# EAGLE design batterytester (EAGLE 6.3)

## Sheet 1 of 2
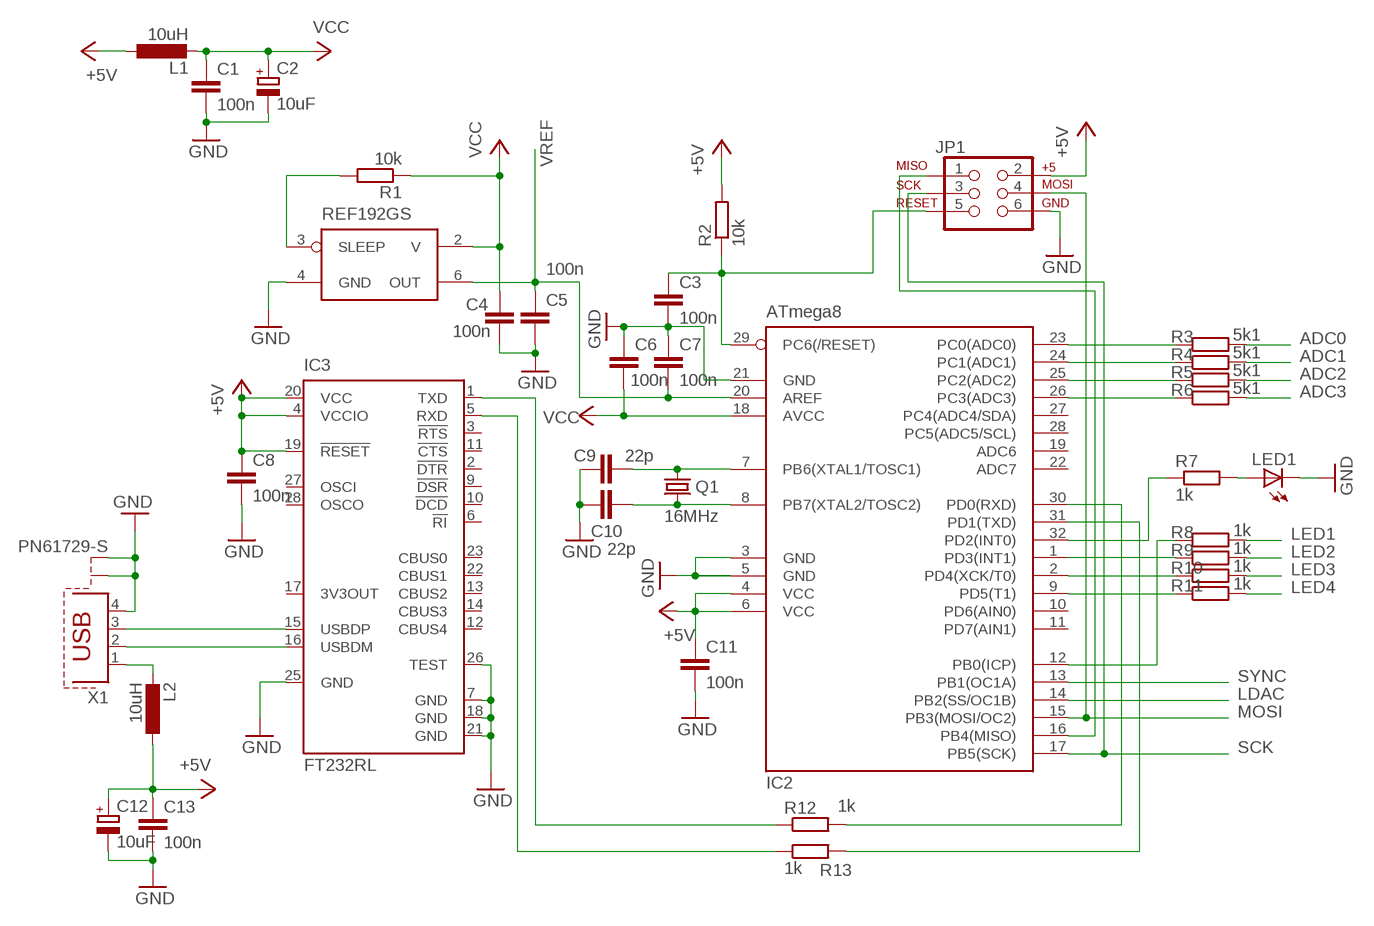
[diagram p0: schematic, sheet 1]

### Parts
C1  100n  C-EUC0805  [C0805]
C2  10uF  CPOL-EUSMCB  [SMC_B]
C3  100n  C-EUC0805  [C0805]
C4  100n  C-EUC0805  [C0805]
C5  100n  C-EUC0805  [C0805]
C6  100n  C-EUC0805  [C0805]
C7  100n  C-EUC0805  [C0805]
C8  100n  C-EUC0805  [C0805]
C9  22p  C-EUC0805  [C0805]
C10  22p  C-EUC0805  [C0805]
C11  100n  C-EUC0805  [C0805]
C12  10uF  CPOL-EUSMCB  [SMC_B]
C13  100n  C-EUC0805  [C0805]
IC1  REF192GS  REF192  [SO8]
IC2  ATmega8  MEGA8-AI  [TQFP32-08]
IC3  FT232RL  [SSOP28]
JP1  AVR_SPI_PRG_6NS  [2X3-NS]
L1  10uH  L-EUL1812  [L1812]
L2  10uH  L-EUL1812  [L1812]
LED1  LED3MM  [LED3MM]
Q1  16MHz  CRYSTALHC49S  [HC49/S]
R1  10k  R-EU_R0805  [R0805]
R2  10k  R-EU_R0805  [R0805]
R3  5k1  R-EU_R0805  [R0805]
R4  5k1  R-EU_R0805  [R0805]
R5  5k1  R-EU_R0805  [R0805]
R6  5k1  R-EU_R0805  [R0805]
R7  1k  R-EU_R0805  [R0805]
R8  1k  R-EU_R0805  [R0805]
R9  1k  R-EU_R0805  [R0805]
R10  1k  R-EU_R0805  [R0805]
R11  1k  R-EU_R0805  [R0805]
R12  1k  R-EU_R0805  [R0805]
R13  1k  R-EU_R0805  [R0805]
X1  PN61729-S  [PN61729-S]

### Nets
+5V: C8.1 C11.1 C12.+ C13.1 IC2.4(VCC) IC2.6(VCC) IC3.4(VCCIO) IC3.19(!RESET) IC3.20(VCC) JP1.2 L1.1 L2.1 R2.2 ; also sheet 2
ADC0: R3.2 ; also sheet 2
ADC1: R4.2 ; also sheet 2
ADC2: R5.2 ; also sheet 2
ADC3: R6.2 ; also sheet 2
GND: C1.2 C2.- C3.2 C4.2 C5.2 C6.1 C7.1 C8.2 C9.1 C10.1 C11.2 C12.- C13.2 IC1.4(GND) IC2.3(GND) IC2.5(GND) IC2.21(GND) IC3.7(GND) IC3.18(GND) IC3.21(GND) IC3.25(GND) IC3.26(TEST) JP1.6 LED1.K(C) X1.4 X1.S1 X1.S2 ; also sheet 2
LDAC: IC2.14(PB2(SS/OC1B)) ; also sheet 2
LED1: R8.2 ; also sheet 2
LED2: R9.2 ; also sheet 2
LED3: R10.2 ; also sheet 2
LED4: R11.2 ; also sheet 2
MOSI: IC2.15(PB3(MOSI/OC2)) JP1.4 ; also sheet 2
N$2: IC3.1(TXD) R12.1
N$3: IC3.5(RXD) R13.1
N$4: IC2.30(PD0(RXD)) R12.2
N$5: C9.2 IC2.7(PB6(XTAL1/TOSC1)) Q1.1
N$6: C10.2 IC2.8(PB7(XTAL2/TOSC2)) Q1.2
N$7: IC2.31(PD1(TXD)) R13.2
N$8: IC3.16(USBDM) X1.2
N$11: IC2.9(PD5(T1)) R11.1
N$12: C3.1 IC2.29(PC6(/RESET)) JP1.5 R2.1
N$13: IC2.2(PD4(XCK/T0)) R10.1
N$14: IC2.12(PB0(ICP)) R8.1
N$15: LED1.A R7.2
N$16: IC2.32(PD2(INT0)) R7.1
N$17: IC2.23(PC0(ADC0)) R3.1
N$18: IC3.15(USBDP) X1.3
N$19: L2.2 X1.1
N$20: IC2.16(PB4(MISO)) JP1.1
N$25: IC1.3(SLEEP) R1.2
N$28: IC2.24(PC1(ADC1)) R4.1
N$29: IC2.25(PC2(ADC2)) R5.1
N$30: IC2.1(PD3(INT1)) R9.1
N$36: IC2.26(PC3(ADC3)) R6.1
SCK: IC2.17(PB5(SCK)) JP1.3 ; also sheet 2
SYNC: IC2.13(PB1(OC1A)) ; also sheet 2
VCC: C1.1 C2.+ C4.1 C6.2 IC1.2(V) IC2.18(AVCC) L1.2 R1.1 ; also sheet 2
VREF: C5.1 C7.2 IC1.6(OUT) IC2.20(AREF) ; also sheet 2
Unconnected: IC2.10(PD6(AIN0)) IC2.11(PD7(AIN1)) IC2.19(ADC6) IC2.22(ADC7) IC2.27(PC4(ADC4/SDA)) IC2.28(PC5(ADC5/SCL)) IC3.2(!DTR) IC3.3(!RTS) IC3.6(!RI) IC3.9(!DSR) IC3.10(!DCD) IC3.11(!CTS) IC3.12(CBUS4) IC3.13(CBUS2) IC3.14(CBUS3) IC3.17(3V3OUT) IC3.22(CBUS1) IC3.23(CBUS0) IC3.27(OSCI) IC3.28(OSCO)

## Sheet 2 of 2
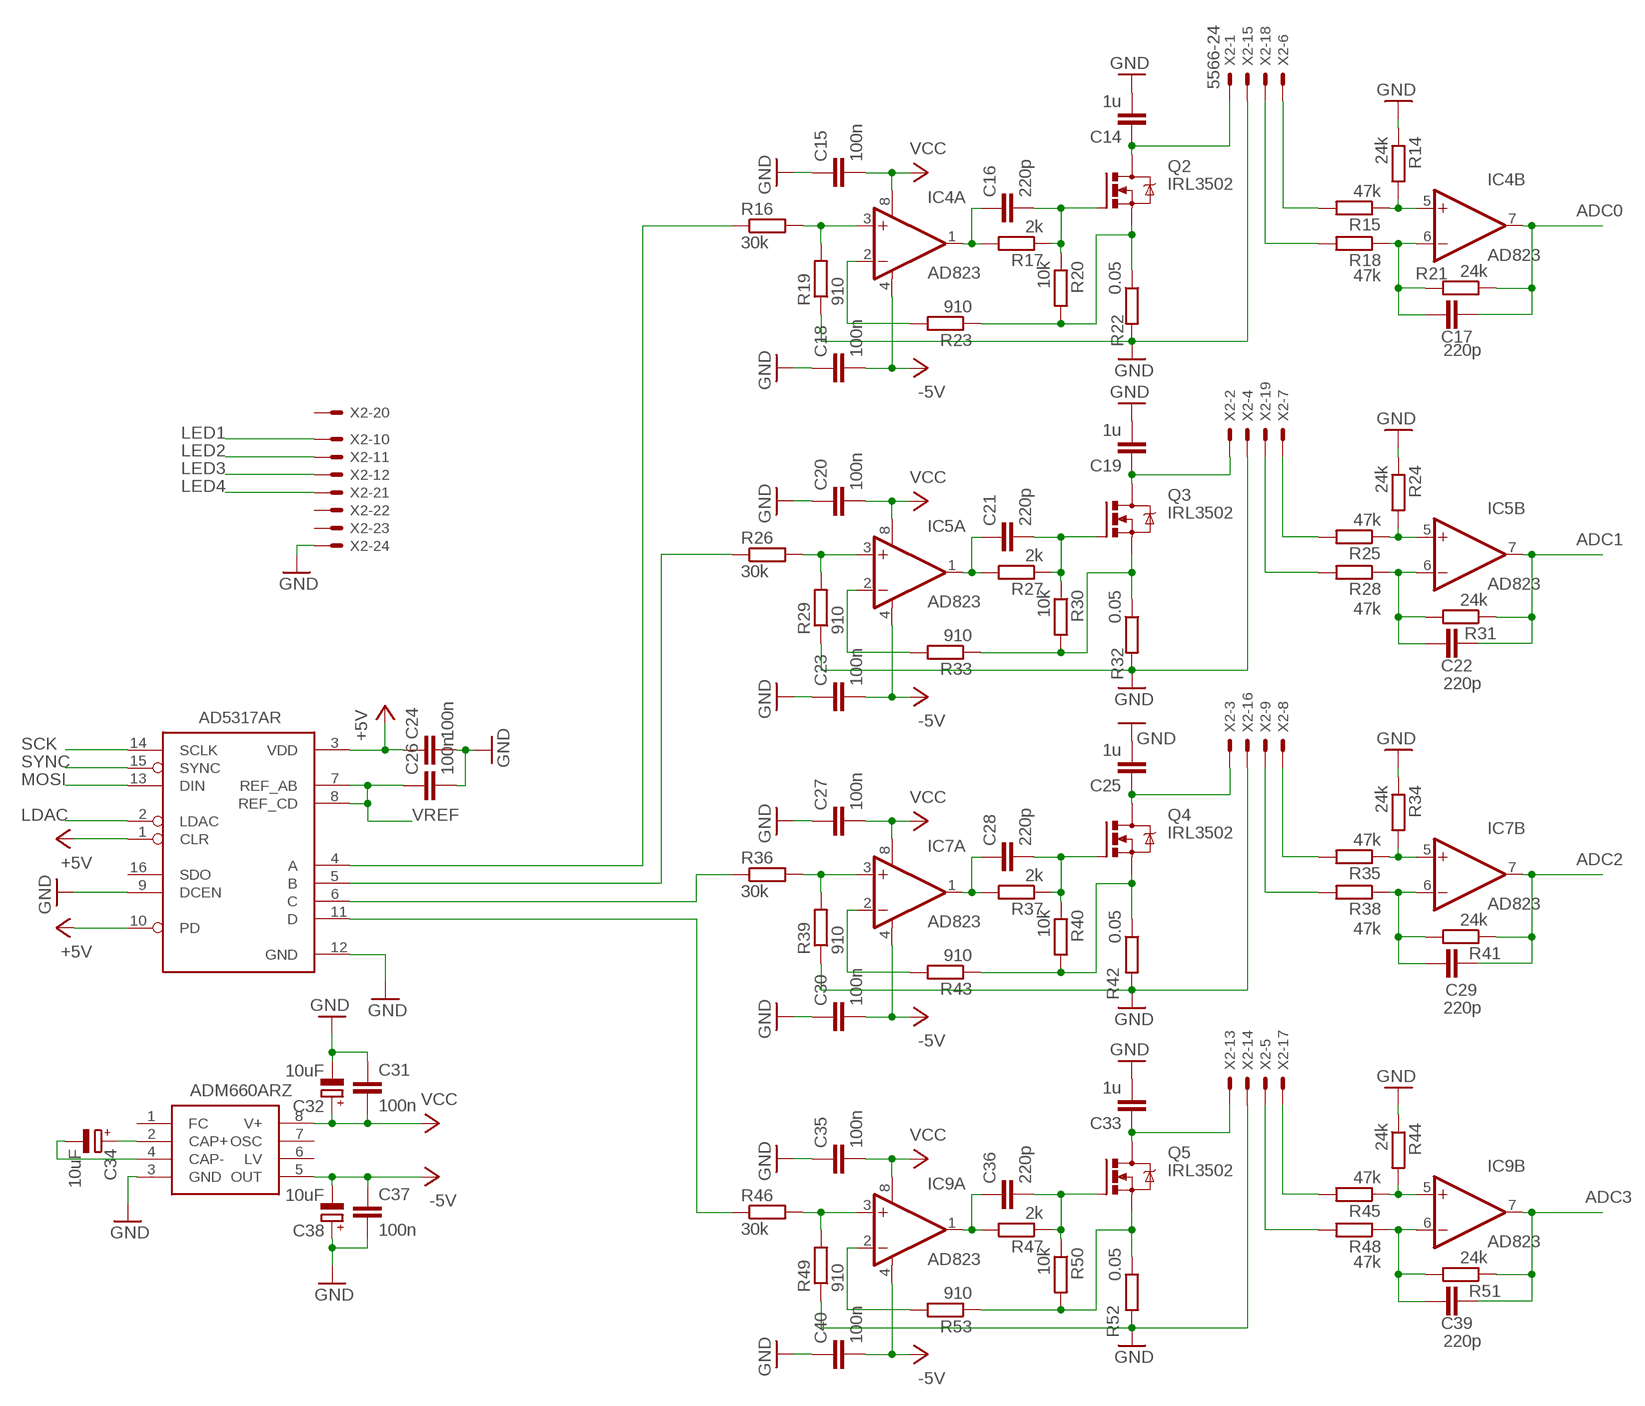
[diagram p1: schematic, sheet 2]

### Parts
C14  1u  C-EUC0805  [C0805]
C15  100n  C-EUC0805  [C0805]
C16  220p  C-EUC0805  [C0805]
C17  220p  C-EUC0805  [C0805]
C18  100n  C-EUC0805  [C0805]
C19  1u  C-EUC0805  [C0805]
C20  100n  C-EUC0805  [C0805]
C21  220p  C-EUC0805  [C0805]
C22  220p  C-EUC0805  [C0805]
C23  100n  C-EUC0805  [C0805]
C24  100n  C-EUC0805  [C0805]
C25  1u  C-EUC0805  [C0805]
C26  100n  C-EUC0805  [C0805]
C27  100n  C-EUC0805  [C0805]
C28  220p  C-EUC0805  [C0805]
C29  220p  C-EUC0805  [C0805]
C30  100n  C-EUC0805  [C0805]
C31  100n  C-EUC0805  [C0805]
C32  10uF  CPOL-EUSMCB  [SMC_B]
C33  1u  C-EUC0805  [C0805]
C34  10uF  CPOL-EUSMCB  [SMC_B]
C35  100n  C-EUC0805  [C0805]
C36  220p  C-EUC0805  [C0805]
C37  100n  C-EUC0805  [C0805]
C38  10uF  CPOL-EUSMCB  [SMC_B]
C39  220p  C-EUC0805  [C0805]
C40  100n  C-EUC0805  [C0805]
IC4  AD823  [SO8]
IC5  AD823  [SO8]
IC6  AD5317AR  AD5317  [TSSOP16]
IC7  AD823  [SO8]
IC8  ADM660ARZ  ADM660  [SO8]
IC9  AD823  [SO8]
Q2  IRL3502  IRF540  [TO220BV]
Q3  IRL3502  IRF540  [TO220BV]
Q4  IRL3502  IRF540  [TO220BV]
Q5  IRL3502  IRF540  [TO220BV]
R14  24k  R-EU_R0805  [R0805]
R15  47k  R-EU_R0805  [R0805]
R16  30k  R-EU_R0805  [R0805]
R17  2k  R-EU_R0805  [R0805]
R18  47k  R-EU_R0805  [R0805]
R19  910  R-EU_R0805  [R0805]
R20  10k  R-EU_R0805  [R0805]
R21  24k  R-EU_R0805  [R0805]
R22  0.05  R-EU_R2512  [R2512]
R23  910  R-EU_R0805  [R0805]
R24  24k  R-EU_R0805  [R0805]
R25  47k  R-EU_R0805  [R0805]
R26  30k  R-EU_R0805  [R0805]
R27  2k  R-EU_R0805  [R0805]
R28  47k  R-EU_R0805  [R0805]
R29  910  R-EU_R0805  [R0805]
R30  10k  R-EU_R0805  [R0805]
R31  24k  R-EU_R0805  [R0805]
R32  0.05  R-EU_R2512  [R2512]
R33  910  R-EU_R0805  [R0805]
R34  24k  R-EU_R0805  [R0805]
R35  47k  R-EU_R0805  [R0805]
R36  30k  R-EU_R0805  [R0805]
R37  2k  R-EU_R0805  [R0805]
R38  47k  R-EU_R0805  [R0805]
R39  910  R-EU_R0805  [R0805]
R40  10k  R-EU_R0805  [R0805]
R41  24k  R-EU_R0805  [R0805]
R42  0.05  R-EU_R2512  [R2512]
R43  910  R-EU_R0805  [R0805]
R44  24k  R-EU_R0805  [R0805]
R45  47k  R-EU_R0805  [R0805]
R46  30k  R-EU_R0805  [R0805]
R47  2k  R-EU_R0805  [R0805]
R48  47k  R-EU_R0805  [R0805]
R49  910  R-EU_R0805  [R0805]
R50  10k  R-EU_R0805  [R0805]
R51  24k  R-EU_R0805  [R0805]
R52  0.05  R-EU_R2512  [R2512]
R53  910  R-EU_R0805  [R0805]
X2  5566-24  5566-245569-24  [5569-24]

### Nets
+5V: C24.1 IC6.1(CLR) IC6.3(VDD) IC6.10(PD) ; also sheet 1
-5V: C18.2 C23.2 C30.2 C37.1 C38.- C40.2 IC4.4(A:V-) IC5.4(A:V-) IC7.4(A:V-) IC8.5(OUT) IC9.4(A:V-)
ADC0: C17.2 IC4.7(B:OUT) R21.1 ; also sheet 1
ADC1: C22.2 IC5.7(B:OUT) R31.1 ; also sheet 1
ADC2: C29.2 IC7.7(B:OUT) R41.1 ; also sheet 1
ADC3: C39.2 IC9.7(B:OUT) R51.1 ; also sheet 1
B0: C14.1 Q2.D X2.1
B0+: R15.2 X2.6
B0-: R18.2 X2.18
B1: C19.1 Q3.D X2.2
B1+: R25.2 X2.7
B1-: R28.2 X2.19
B2: C25.1 Q4.D X2.3
B2+: R35.2 X2.8
B2-: R38.2 X2.9
B3: C33.1 Q5.D X2.13
B3+: R45.2 X2.17
B3-: R48.2 X2.5
GND: C14.2 C15.1 C18.1 C19.2 C20.1 C23.1 C24.2 C25.2 C26.2 C27.1 C30.1 C31.1 C32.- C33.2 C35.1 C37.2 C38.+ C40.1 IC6.9(DCEN) IC6.12(GND) IC8.3(GND) R14.1 R19.1 R22.2 R24.1 R29.1 R32.2 R34.1 R39.1 R42.2 R44.1 R49.1 R52.2 X2.4 X2.14 X2.15 X2.16 X2.24 ; also sheet 1
LDAC: IC6.2(LDAC) ; also sheet 1
LED1: X2.10 ; also sheet 1
LED2: X2.11 ; also sheet 1
LED3: X2.12 ; also sheet 1
LED4: X2.21 ; also sheet 1
MOSI: IC6.13(DIN) ; also sheet 1
N$1: IC4.3(A:+IN) R16.2 R19.2
N$9: Q2.S R20.2 R22.1 R23.1
N$10: Q3.S R30.2 R32.1 R33.1
N$21: C34.+ IC8.2(CAP+)
N$22: C34.- IC8.4(CAP-)
N$23: IC4.2(A:-IN) R23.2
N$24: C16.1 IC4.1(A:OUT) R17.2
N$26: C16.2 Q2.G R17.1 R20.1
N$27: Q4.S R40.2 R42.1 R43.1
N$34: IC4.5(B:+IN) R14.2 R15.1
N$35: C17.1 IC4.6(B:-IN) R18.1 R21.2
N$37: Q5.S R50.2 R52.1 R53.1
N$38: IC5.3(A:+IN) R26.2 R29.2
N$39: IC5.2(A:-IN) R33.2
N$40: C21.1 IC5.1(A:OUT) R27.2
N$41: C21.2 Q3.G R27.1 R30.1
N$47: IC5.5(B:+IN) R24.2 R25.1
N$48: C22.1 IC5.6(B:-IN) R28.1 R31.2
N$50: IC7.3(A:+IN) R36.2 R39.2
N$51: IC7.2(A:-IN) R43.2
N$52: C28.1 IC7.1(A:OUT) R37.2
N$53: C28.2 Q4.G R37.1 R40.1
N$59: IC7.5(B:+IN) R34.2 R35.1
N$60: C29.1 IC7.6(B:-IN) R38.1 R41.2
N$62: IC9.3(A:+IN) R46.2 R49.2
N$63: IC9.2(A:-IN) R53.2
N$64: C36.1 IC9.1(A:OUT) R47.2
N$65: C36.2 Q5.G R47.1 R50.1
N$71: IC9.5(B:+IN) R44.2 R45.1
N$72: C39.1 IC9.6(B:-IN) R48.1 R51.2
N$74: IC6.4(A) R16.1
N$75: IC6.5(B) R26.1
N$76: IC6.6(C) R36.1
N$77: IC6.11(D) R46.1
SCK: IC6.14(SCLK) ; also sheet 1
SYNC: IC6.15(SYNC) ; also sheet 1
VCC: C15.2 C20.2 C27.2 C31.2 C32.+ C35.2 IC4.8(A:V+) IC5.8(A:V+) IC7.8(A:V+) IC8.8(V+) IC9.8(A:V+) ; also sheet 1
VREF: C26.1 IC6.7(REF_AB) IC6.8(REF_CD) ; also sheet 1
Unconnected: IC6.16(SDO) IC8.1(FC) IC8.6(LV) IC8.7(OSC) X2.20 X2.22 X2.23

## Library data of the parts
C1 C3-C11 C13-C31 C33 C35-C37 C39 C40 = olegart-passive:C-EU: CAPACITOR, European symbol
C2 C12 C32 C34 C38 = olegart-passive:CPOL-EU: POLARIZED CAPACITOR, European symbol
IC1 = batterytester:REF192: Precision Micropower, Low Dropout Voltage References
IC2 = atmel:MEGA8: MICROCONTROLLER 8 Kbytes FLASH, 1 kbytes SRAM, 512 bytes EEPROM, USART, 6-channel 10 bit ADC, 2-channel 8 bit ADC Pin compatible with Atmega48, ATMega88, ATMega168 Source: avr.lbr
IC3 = ftdichip:FT232R: Source: http://www.ftdichip.com/Documents/DataSheets/DS_FT232R_v104.pdf
IC4 IC5 IC7 IC9 = olegart-ic:AD823: Dual, 16 MHz, Rail-to-Rail FET Input Amplifier AD823
IC6 = batterytester:AD5317: AD5317 10-bit 4-channel DAC
IC8 = olegart-ic:ADM660: CMOS Switched-Capacitor Voltage Converter
JP1 = olegart-connectors:AVR_SPI_PRG_6: AVR ISP 6 Pin This is the reduced ISP connector for AVR programming. Common on Arduino. This footprint will take up less PCB space and can be used with a 10-pin to 6-pin adapter such as SKU: BOB-08508
L1 L2 = resistor:L-EU: INDUCTOR, European symbol
LED1 = olegart-opto:LED: LED OSRAM: - CHIPLED LG R971, LG N971, LY N971, LG Q971, LY Q971, LO R971, LY R971 LH N974, LH R974 LS Q976, LO Q976, LY Q976 LO Q996 - Hyper CHIPLED LW Q18S LB Q993, LB Q99A, LB R99A - SideLED LS A670, LO A670, LY A670, LG A670, LP A670 LB A673, LV A673, LT A673, LW A673 LH A674 LY A675 LS A676, LA A676, LO A676, LY A676, LW A676 LS A679, LY A679, LG A679 - Hyper Micro SIDELED® LS Y876, LA Y876, LO Y876, LY Y876 LT Y87S - SmartLED LW L88C, LW L88S LB L89C, LB L89S, LG L890 LS L89K, LO L89K, LY L89K LS L896, LA L896, LO L896, LY L896 - TOPLED LS T670, LO T670, LY T670, LG T670, LP T670 LSG T670, LSP T670, LSY T670, LOP T670, LYG T670 LG T671, LOG T671, LSG T671 LB T673, LV T673, LT T673, LW T673 LH T674 LS T676, LA T676, LO T676, LY T676, LB T676, LH T676, LSB T676, LW T676 LB T67C, LV T67C, LT T67C, LS T67K, LO T67K, LY T67K, LW E67C LS E67B, LA E67B, LO E67B, LY E67B, LB E67C, LV E67C, LT E67C LW T67C LS T679, LY T679, LG T679 LS T770, LO T770, LY T770, LG T770, LP T770 LB T773, LV T773, LT T773, LW T773 LH T774 LS E675, LA E675, LY E675, LS T675 LS T776, LA T776, LO T776, LY T776, LB T776 LHGB T686 LT T68C, LB T68C - Hyper Mini TOPLED® LB M676 - Mini TOPLED Santana® LG M470 LS M47K, LO M47K, LY M47K Source: http://www.osram.convergy.de LUXEON: - LUMILED® LXK2-PW12-R00, LXK2-PW12-S00, LXK2-PW14-U00, LXK2-PW14-V00 LXK2-PM12-R00, LXK2-PM12-S00, LXK2-PM14-U00 LXK2-PE12-Q00, LXK2-PE12-R00, LXK2-PE12-S00, LXK2-PE14-T00, LXK2-PE14-U00 LXK2-PB12-K00, LXK2-PB12-L00, LXK2-PB12-M00, LXK2-PB14-N00, LXK2-PB14-P00, LXK2-PB14-Q00 LXK2-PR12-L00, LXK2-PR12-M00, LXK2-PR14-Q00, LXK2-PR14-R00 LXK2-PD12-Q00, LXK2-PD12-R00, LXK2-PD12-S00 LXK2-PH12-R00, LXK2-PH12-S00 LXK2-PL12-P00, LXK2-PL12-Q00, LXK2-PL12-R00 Source: www.luxeon.com KINGBRIGHT: KA-3528ASYC Source: www.kingbright.com
Q1 = crystal:CRYSTAL: CRYSTAL
Q2-Q5 = transistor-power:IRF540: HEXFET Power MOSFET
R1-R53 = olegart-passive:R-EU_: RESISTOR, European symbol
X1 = con-berg:PN61729-S: BERG USB connector
X2 = batterytester:5566-24: Mini FIT connector 24 pol Source: http://www.molex.com

## Board
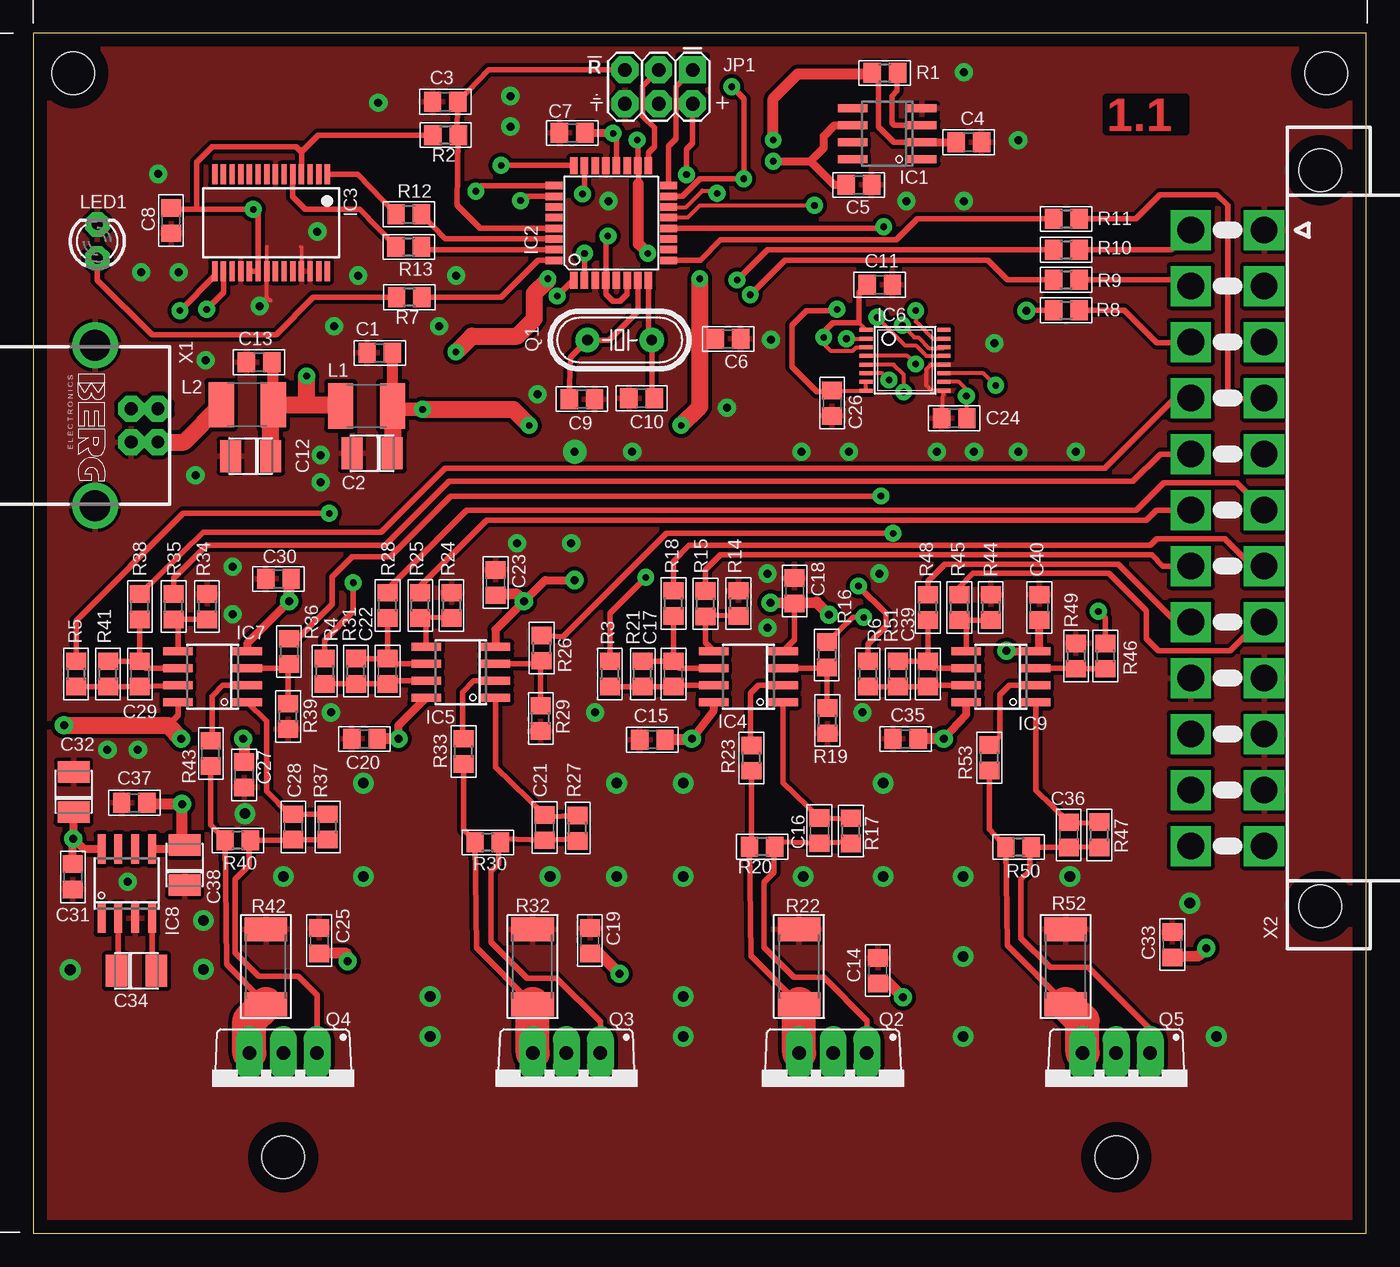
[diagram p2: board, top side]
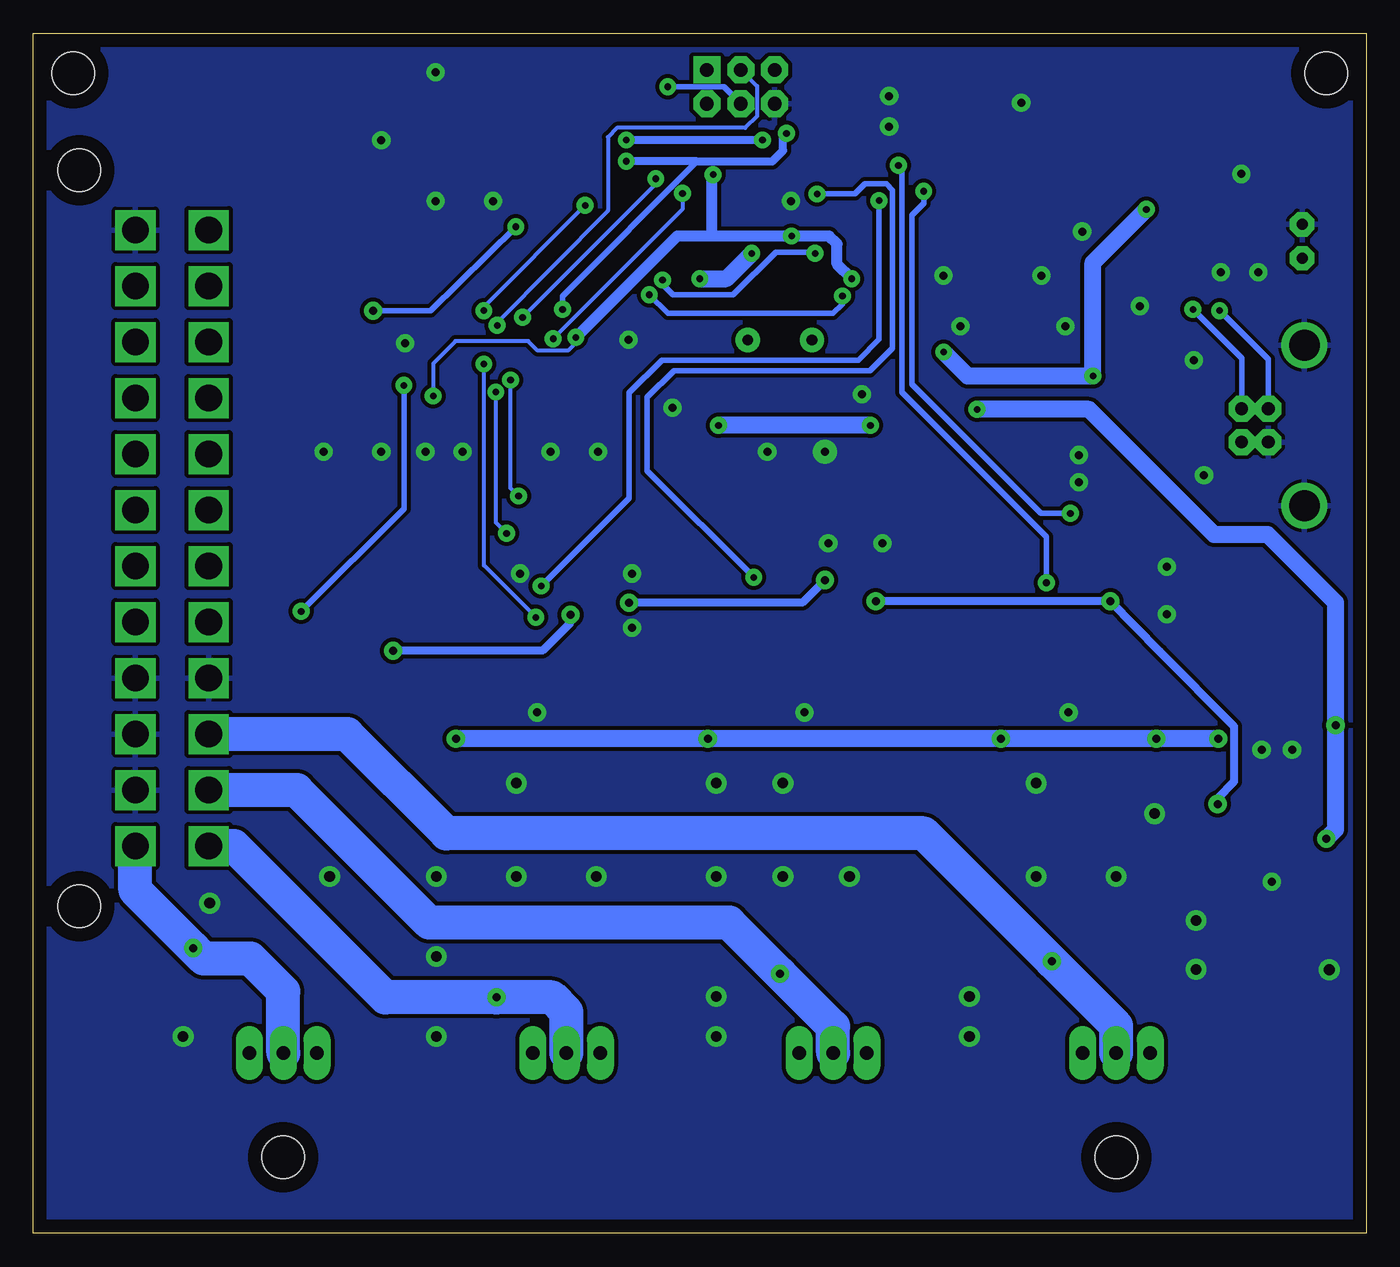
[diagram p3: board, bottom side, seen from below]

Size 100 x 90 mm. Coordinates in mm from the lower left corner, seen from the top.
Outline: 0,0 100,0 100,90 0,90 0,0
Copper layers (1*16): Top 0.035mm / dielectric 1.5mm / Bottom 0.035mm
Design rules "batterytester": minimum track width 10mil, minimum drill 24mil, track to track 0.3mm, track to pad 0.3mm, pad to pad 0.3mm, via to via 0.3mm, smd to smd 8mil, copper to edge 40mil, drill to drill 8mil, minimum pad ring 20mil, minimum via ring 15mil, stop-mask expansion 4mil, vias tented up to drill 0mil, thermal gap 10mil
Holes 3.2 mm at 18.75,5.7 81.25,5.7 3,87 97,87

### Footprints (pad centres in the part's own frame; a part is rotated, then mirrored left to right if it is on the bottom)
C0805 = smd 1.3 x 1.5: 1 -0.95,0; 2 0.95,0
SMC_B = smd 1.6 x 2.4: + -1.5,0; - 1.5,0
SO8 = smd 0.6 x 2.2: 1 -1.905,-2.6; 2 -0.635,-2.6; 3 0.635,-2.6; 4 1.905,-2.6; 5 1.905,2.6; 6 0.635,2.6; 7 -0.635,2.6; 8 -1.905,2.6
TQFP32-08 = smd 1.27 x 0.559: 1 -4.293,2.8; 2 -4.293,2; 3 -4.293,1.2; 4 -4.293,0.4; 5 -4.293,-0.4; 6 -4.293,-1.2; 7 -4.293,-2; 8 -4.293,-2.8; 17 4.293,-2.8; 18 4.293,-2; 19 4.293,-1.2; 20 4.293,-0.4; 21 4.293,0.4; 22 4.293,1.2; 23 4.293,2; 24 4.293,2.8 | smd 0.559 x 1.27: 9 -2.8,-4.293; 10 -2,-4.293; 11 -1.2,-4.293; 12 -0.4,-4.293; 13 0.4,-4.293; 14 1.2,-4.293; 15 2,-4.293; 16 2.8,-4.293; 25 2.8,4.293; 26 2,4.293; 27 1.2,4.293; 28 0.4,4.293; 29 -0.4,4.293; 30 -1.2,4.293; 31 -2,4.293; 32 -2.8,4.293
SSOP28 = smd 0.4 x 1.5: 1 -4.225,-3.625; 2 -3.575,-3.625; 3 -2.925,-3.625; 4 -2.275,-3.625; 5 -1.625,-3.625; 6 -0.975,-3.625; 7 -0.325,-3.625; 8 0.325,-3.625; 9 0.975,-3.625; 10 1.625,-3.625; 11 2.275,-3.625; 12 2.925,-3.625; 13 3.575,-3.625; 14 4.225,-3.625; 15 4.225,3.625; 16 3.575,3.625; 17 2.925,3.625; 18 2.275,3.625; 19 1.625,3.625; 20 0.975,3.625; 21 0.325,3.625; 22 -0.325,3.625; 23 -0.975,3.625; 24 -1.625,3.625; 25 -2.275,3.625; 26 -2.925,3.625; 27 -3.575,3.625; 28 -4.225,3.625
TSSOP16 = smd 0.305 x 0.991: 1 -2.275,-2.918; 2 -1.625,-2.918; 3 -0.975,-2.918; 4 -0.325,-2.918; 5 0.325,-2.918; 6 0.975,-2.918; 7 1.625,-2.918; 8 2.275,-2.918; 9 2.275,2.918; 10 1.625,2.918; 11 0.975,2.918; 12 0.325,2.918; 13 -0.325,2.918; 14 -0.975,2.918; 15 -1.625,2.918; 16 -2.275,2.918
2X3-NS = drill 1.016 square: 1 -2.54,-1.27 | drill 1.016 octagon: 2 -2.54,1.27; 3 0,-1.27; 4 0,1.27; 5 2.54,-1.27; 6 2.54,1.27
L1812 = smd 1.9 x 3.4: 1 -1.95,0; 2 1.95,0
LED3MM = drill 0.813 octagon: A -1.27,0; K 1.27,0
HC49/S = drill 0.813: 1 -2.413,0; 2 2.413,0
TO220BV = drill 1.016 long: D 0,-2.54; G -2.54,-2.54; S 2.54,-2.54
R0805 = smd 1.3 x 1.5: 1 -0.95,0; 2 0.95,0
R2512 = smd 1.8 x 3.2: 1 -2.8,0; 2 2.8,0
PN61729-S = drill 0.95 octagon: 1 1.25,4.71; 2 -1.25,4.71; 3 -1.25,2.71; 4 1.25,2.71 | drill 2.3 pad 2.9: S1 -6.02,0; S2 6.02,0
5569-24 = drill 2 square: 1 23.1,-2.75; 2 18.9,-2.75; 3 14.7,-2.75; 4 10.5,-2.75; 5 6.3,-2.75; 6 2.1,-2.75; 7 -2.1,-2.75; 8 -6.3,-2.75; 9 -10.5,-2.75; 10 -14.7,-2.75; 11 -18.9,-2.75; 12 -23.1,-2.75; 13 23.1,2.75; 14 18.9,2.75; 15 14.7,2.75; 16 10.5,2.75; 17 6.3,2.75; 18 2.1,2.75; 19 -2.1,2.75; 20 -6.3,2.75; 21 -10.5,2.75; 22 -14.7,2.75; 23 -18.9,2.75; 24 -23.1,2.75 | hole 3.2: -27.6,6.95; 27.6,6.95

### Placement (x,y rotation side)
C1  25.99,66.03 180 top
C2  25.42,58.49 180 top
C3  30.91,84.87 180 top
C4  70.19,81.83 0 top
C5  61.94,78.63 0 top
C6  52.12,67.08 180 top
C7  40.42,82.53 0 top
C8  10.33,75.96 270 top
C9  41.15,62.57 180 top
C10  45.63,62.63 0 top
C11  63.5,71.15 0 top
C12  16.3,58.29 180 top
C13  16.94,65.33 180 top
C14  63.35,19.7 90 top
C15  46.44,37.03 0 top
C16  58.98,30.21 270 top
C17  48.02,41.96 270 top
C18  57.12,48.19 270 top
C19  41.75,21.95 90 top
C20  24.84,37.08 0 top
C21  38.35,30.43 270 top
C22  26.57,42.16 270 top
C23  34.68,48.81 270 top
C24  69.09,61.13 180 top
C25  21.45,21.95 90 top
C26  59.93,62.26 270 top
C27  15.82,34.39 90 top
C28  19.5,30.48 270 top
C29  8,41.96 270 top
C30  18.39,49.08 0 top
C31  2.97,26.74 90 top
C32  3.02,33.11 90 top
C33  85.45,21.65 90 top
C34  7.74,19.69 0 top
C35  65.44,37.08 0 top
C36  77.68,29.89 270 top
C37  7.59,32.29 180 top
C38  11.34,27.62 90 top
C39  67.12,41.96 270 top
C40  75.47,46.95 270 top
IC1  64.07,82.46 90 top
IC2  43.35,75.78 90 top
IC3  17.84,75.8 180 top
IC4  53.65,41.75 90 top
IC5  32.08,42.08 90 top
IC6  65.4,65.48 270 top
IC7  13.45,41.75 90 top
IC8  7.02,26.23 0 top
IC9  72.6,41.75 90 top
JP1  46.92,85.99 180 top
L1  25,62.06 0 top
L2  16.05,62.14 180 top
LED1  4.8,74.4 90 top
Q1  43.99,67 0 top
Q2  60,11 180 top
Q3  40,11 180 top
Q4  18.75,11 180 top
Q5  81.25,11 180 top
R1  63.89,87.03 0 top
R2  30.93,82.37 180 top
R3  43.25,41.96 270 top
R4  21.85,42.16 270 top
R5  3.2,41.96 270 top
R6  62.6,41.96 270 top
R7  28.2,70.2 180 top
R8  77.5,69.23 0 top
R9  77.5,71.53 0 top
R10  77.5,73.78 0 top
R11  77.5,76.08 0 top
R12  28.17,76.43 0 top
R13  28.16,73.98 0 top
R14  52.92,47.24 270 top
R15  50.42,47.22 90 top
R16  59.53,43.39 270 top
R17  61.34,30.18 90 top
R18  48.02,47.24 90 top
R19  59.57,38.46 90 top
R20  54.67,29 180 top
R21  45.72,41.96 90 top
R22  57.46,20 90 top
R23  53.87,35.65 90 top
R24  31.37,47.09 270 top
R25  29.03,47.1 90 top
R26  38.13,43.9 270 top
R27  40.84,30.39 90 top
R28  26.57,47.09 90 top
R29  38.07,38.62 90 top
R30  34.09,29.32 180 top
R31  24.2,42.16 90 top
R32  37.46,20 90 top
R33  32.27,36.14 90 top
R34  13.03,47 270 top
R35  10.52,47 90 top
R36  19.18,43.65 270 top
R37  22.07,30.48 90 top
R38  8,47 90 top
R39  19.12,38.77 90 top
R40  15.35,29.47 180 top
R41  5.6,41.96 90 top
R42  17.46,20 90 top
R43  13.32,35.99 90 top
R44  71.83,46.95 270 top
R45  69.47,46.95 90 top
R46  80.43,43.3 270 top
R47  79.97,29.89 90 top
R48  67.12,46.95 90 top
R49  78.23,43.3 270 top
R50  73.92,28.97 180 top
R51  64.87,41.96 90 top
R52  77.46,20 90 top
R53  71.72,35.67 90 top
X1  4.63,60.59 270 top
X2  89.59,52.14 270 top

### Tracks (layer width: path | path; a pad name or v marks a point on that pad's centre or on a via)
+5V  (via drill 0.5)
  Top 0.305: 61.94,68.3 IC6.1 | IC6.3 61.76,66.45 61.5,66.2 59.8,66.2 59.4,66.6 59.4,67.1 | IC6.10 69.44,63.85 70,63.3 v70,62.8 70,61.19 C24.1
  Top 0.406: IC2.6 44.55,70.45 44,69.9 43.5,69.9 42.95,70.45 IC2.4 42.95,74.45 v43.11,74.8 | IC3.19 IC3.20 16.86,76.44 v16.5,76.8 12.25,76.8 | R2.2 21.37,82.37 20.11,81.11 20.11,81.08 | v59.3,67.2 59.4,67.1 59.4,67.7 60,68.3 61.94,68.3 61.94,70.53 C11.1 | v49,79.4 49,81.3 49.46,81.76 JP1.2 | 20.11,81.08 19.7,81.5 13.4,81.5 12.25,80.35 12.25,76.8 | 20.11,81.08 IC3.4 | C8.1 10.34,76.8 12.25,76.8
  Top 0.61: 38.6,71.5 v38.6,71.6
  Top 0.813: C13.1 18,65.12 L2.1
  Top 1.27: v31.7,66.1 32.9,67.3 36.3,67.3 37.6,68.6 37.6,70.5 38.6,71.5 | 20.5,62.14 L2.1 17.8,61.94 C12.+ | L1.1 23.05,62.14 20.5,62.14 | 20.5,62.14 v20.5,64.3
  Bottom 0.305: v70,62.8 70,65.23 68.32,66.91 62.87,66.91 62.16,66.2 59.9,66.2 59.4,66.7 59.4,67.1 v59.3,67.2
  Bottom 0.813: v38.6,71.6 39.7,72.7 39.7,74.2 40.3,74.8 v43.11,74.8 49.1,74.8 | 49.1,74.8 49.1,79.3 v49,79.4 | 49.1,74.8 51.7,74.8 v59.3,67.2
  Bottom 1.27: v31.7,66.1 29.9,64.3 v20.5,64.3 20.5,72.8 v16.5,76.8
-5V  (via drill 0.6)
  Top 0.406: IC4.4 57.12,44.52 C18.2
  Top 0.61: IC5.4 34.67,45.27 v36.8,47.4 38.4,49 v40.6,49 | v73,43.7 73.05,43.66 IC9.4 75.47,43.92 C40.2 | 19.1,47.3 v19.2,47.4 16.05,44.25 IC7.4 | v11.15,32.2 v11.14,32.19 | IC8.5 10.54,28.83 C38.-
  Top 0.813: v55.3,47.3 55.34,47.34 C18.2 58.76,47.34 v59.7,46.4 | C23.2 36.24,47.96 v36.8,47.4 | v19.2,47.4 19.2,49.09 C30.2 | C38.- 11.15,29.31 v11.15,32.2 8.6,32.2 C37.1
  Bottom 0.61: v36.8,47.4 v19.2,47.4 15.47,43.63 9.9,38 9.9,33.9 11.15,32.65 v11.15,32.2 | v40.6,49 42.3,47.3 v55.3,47.3 | v73,43.7 61.8,43.7 59.7,45.8 v59.7,46.4
ADC0
  Top 0.406: IC4.7 48.02,41.11 C17.2 R21.1 R3.2
ADC1
  Top 0.406: IC5.7 26.7,41.44 C22.2 R31.1 R4.2
ADC2
  Top 0.406: IC7.7 C29.2 R41.1 R5.2
ADC3
  Top 0.406: IC9.7 67.12,41.11 C39.2 R51.1 R6.2
B0  (via drill 0.6)
  Top 0.813: C14.1 64.1,18.85 v65.25,17.7
  Bottom 2.54: Q2.D 60,16.6 61.1,17.7 v65.25,17.7 73.6,17.7 84.94,29.04 X2.1
B0+
  Top 0.406: X2.6 84.76,50.04 83.9,50.9 51.57,50.9 50.42,49.75 R15.2
B0-
  Top 0.406: X2.18 91.46,50.04 89.4,52.1 84.3,52.1 83.8,51.6 49.2,51.6 48.02,50.42 R18.2
B1  (via drill 0.6)
  Top 0.813: C19.1 42.35,21.1 v43.98,19.48
  Bottom 2.54: Q3.D 40,15.5 v43.98,19.48 47.8,23.3 70.3,23.3 80.24,33.24 X2.2
B1+
  Top 0.406: X2.7 84.24,54.24 83.5,53.5 34.02,53.5 29.03,48.51 R25.2
B1-
  Top 0.406: X2.19 90.28,56.3 84.8,56.3 82.74,54.24 32.52,54.24 26.57,48.29 R28.2
B2  (via drill 0.6)
  Top 0.813: C25.1 23.5,21 v23.59,20.4
  Bottom 2.54: X2.3 76.44,37.44 69,30 33.19,30 v23.59,20.4 18.75,15.56 Q4.D
B2+
  Top 0.406: X2.8 84.54,58.44 82.5,56.4 31.2,56.4 26.4,51.6 13,51.6 10.52,49.12 R35.2
B2-
  Top 0.406: X2.9 85.64,62.64 80.4,57.4 30.9,57.4 26.1,52.6 12.74,52.6 R38.2
B3  (via drill 0.6)
  Top 0.813: C33.1 87.4,20.8 v88,21.4
  Bottom 2.54: X2.13 92.34,25.74 v88,21.4 87.2,20.6 83.7,20.6 81.25,18.15 Q5.D
B3+
  Top 0.406: X2.17 91.94,45.84 89.8,43.7 84.4,43.7 83.5,44.6 83.5,46.7 80.7,49.5 70.5,49.5 69.5,48.5 69.5,47.81 R45.2
B3-
  Top 0.406: X2.5 85.76,45.84 81.4,50.2 68.4,50.2 67.1,48.9 67.1,47.82 R48.2
GND  (via drill 0.6, 0.6 pad 1.78, 0.8)
  Top 0.254: IC3.25 20.11,73.96 20.07,74.01 | IC3.21 17.52,74 17.53,74.01
  Top 0.305: IC6.12 67.36,65.16 67,64.8 67,63.6 67.39,63.2 IC6.9 68.24,63.13 C24.2 | IC3.21 17.52,70.21 17.78,69.94
  Top 0.61: C24.2 68.2,61.09
  other vias: 48.77,26.76 43.77,26.76 38.77,26.76 57.77,26.76 63.77,26.76 69.77,26.76 48.77,17.76 69.77,20.76 69.77,14.76 48.77,14.76 88.77,14.76 77.77,26.76 86.77,24.76 29.77,14.76 29.77,17.76 18.77,26.76 24.77,26.76 24.77,33.76 48.77,33.76 43.77,33.76 63.77,33.76 12.77,23.46 12.77,19.8 2.77,19.76 5.56,36.27 14.96,49.99 14.96,46.43 36.3,51.77 40.36,51.77 55.09,45.42 55.09,49.48 63.47,49.48 62.2,39.07 42.14,39.07 22.33,39.07 7.85,36.27 7.09,26.37 21.56,58.37 21.56,56.34 12.17,56.85 22.58,68.02 30.45,68.02 31.72,71.83 24.36,71.83 10.9,72.09 8.1,72.09 21.31,75.14 9.37,79.45 25.88,84.79 35.79,85.3 35.79,83.01 43.15,77.42 52.04,61.93 37.82,62.94 40.61,58.63 44.93,58.63 57.63,58.63 61.19,58.63 67.79,58.63 70.59,58.63 73.89,58.63 78.21,58.63 72.11,66.75 55.35,67.01 73.89,81.99 65.51,77.42 69.82,77.42 69.82,87.07 15.88,31.48 16.99,69.55 12.93,65.48
  pour Top: 0.25,89.5 99.57,89.5 99.57,10.25 0.25,10.25
  pour Top: 0.25,89.76 99.57,89.76 99.57,0.1 0.25,0.1
  pour Bottom: 0.25,89.5 99.57,89.5 99.57,0.1 0.25,0.1
LDAC  (via drill 0.5)
  Top 0.305: IC6.2 v61.01,67.1 v61,67.1 | v51.3,78 51.1,78.2 50.2,78.2 48.98,76.97 IC2.14
  Bottom 0.305: v61,67.1 51.3,76.8 v51.3,78
LED1
  Top 0.406: R8.2 81.87,69.23 84.3,66.8 86.81,66.8 X2.10
LED2
  Top 0.406: R9.2 86.36,71.53 X2.11
LED3
  Top 0.406: R10.2 85.39,73.78 X2.12
LED4
  Top 0.406: X2.21 92.31,62.6 90.3,62.6 89.6,63.3 89.6,77.1 88.8,77.9 84.53,77.9 82.71,76.08 R11.2
MOSI  (via drill 0.5)
  Top 0.305: IC6.13 67,65.81 66.2,66.6 65.4,66.6 v63.3,68.7
  Top 0.406: IC2.15 47.67,77.8 48.7,77.8 50,79.1 v53.3,79.1 53.3,85.1 v52.4,86
  Bottom 0.305: v53.3,79.1 53.3,78.7 v63.3,68.7
  Bottom 0.406: JP1.4 48.2,86 v52.4,86
N$1
  Top 0.406: IC4.3 59.38,42.38 R16.2 59.53,39.35 R19.2
N$2
  Top 0.406: R12.1 24.32,79.42 IC3.1
N$3
  Top 0.406: R13.1 24.49,76.8 20.4,76.8 19.46,77.73 IC3.5
N$4
  Top 0.406: R12.2 30.88,74.58 IC2.30
N$5
  Top 0.406: IC2.7 45.35,69.15 43.2,67 Q1.1 40.3,65.72 C9.2
N$6
  Top 0.406: IC2.8 46.15,67.25 Q1.2 46.4,62.71 C10.2
N$7
  Top 0.406: R13.2 29.21,73.78 IC2.31
N$8  (via drill 0.5)
  Top 0.406: v13,69.3 14.27,70.56 IC3.16
  Bottom 0.406: X1.2 9.34,65.64 v13,69.3
N$9
  Top 0.406: R23.1 53.87,29.04 R20.2 53.83,20.84 R22.1
  Top 2.54: Q2.S R22.1
N$10
  Top 0.406: R33.1 32.27,30.3 R30.2 33.24,21.41 R32.1
  Top 2.54: Q3.S R32.1
N$11
  Top 0.406: R11.1 66.33,76.08 64.77,74.52 51.56,74.52 50.04,72.99 47.66,72.99 IC2.9
N$12
  Top 0.406: IC2.29 33.52,75.38 31.78,77.12 R2.1 31.76,82.39 C3.1 34.15,87.26 JP1.5
N$13  (via drill 0.5)
  Top 0.406: IC2.2 v41.35,73.5 | R10.1 55.08,73.78 v52.8,71.5
  Bottom 0.406: v52.8,71.5 52.8,71.2 52,70.4 47.5,70.4 44.3,73.6 41.55,73.6 v41.35,73.5
N$14  (via drill 0.5, 0.6)
  Top 0.406: IC2.12 63.48,75.38 v63.8,75.5 | v74.5,69.2 74.53,69.23 R8.1
  Bottom 0.406: v63.8,75.5 70.2,69.2 v74.5,69.2
N$15
  Top 0.406: R7.2 21,70.2 18.2,67.4 8.9,67.4 4.8,71.5 LED1.A
N$16
  Top 0.406: R7.1 35.1,70.2 37.88,72.97 IC2.32
N$17  (via drill 0.5)
  Top 0.406: R3.1 43.25,46.5 v45.95,49.2 | v41.2,77.95 41.35,78.1 IC2.23
  Bottom 0.406: v45.95,49.2 53.95,57.2 53.95,62.7 51.95,64.7 37.25,64.7 35.55,66.4 35.55,78.25 36,78.7 37.6,78.7 38.35,77.95 v41.2,77.95
N$18  (via drill 0.5)
  Top 0.406: v11,69.2 13.62,71.81 IC3.15
  Bottom 0.406: X1.3 7.34,65.54 v11,69.2
N$19
  Top 1.27: 14.1,61.4 L2.2 11.3,59.34 X1.1
N$20
  Top 0.406: JP1.1 48.2,86 48.2,82.1 47.64,81.54 IC2.16
N$21
  Top 0.406: C34.+ 6.38,19.84 IC8.2
N$22
  Top 0.406: IC8.4 8.93,20.01 C34.-
N$23
  Top 0.406: IC4.2 54.41,41.11 53.8,40.5 53.8,36.57 R23.2
N$24
  Top 0.406: IC4.1 56.25,33.79 C16.1 61.31,31.06 R17.2
N$25
  Top 0.406: IC1.3 64.61,83.09 64.4,83.3 64.4,85.3 64.8,85.7 64.8,86.97 R1.2
N$26
  Top 0.406: R17.1 61.31,29.36 C16.2 55.89,29.36 R20.1 55.55,28.97 55.55,27.1 54.8,26.35 54.8,21.45 57.05,19.2 59.3,19.2 62.54,15.96 Q2.G
N$27
  Top 0.406: R43.1 13.32,30.64 R40.2 14.49,20.16 R42.1
  Top 2.54: R42.1 16.21,15.95 Q4.S
N$28  (via drill 0.5)
  Top 0.406: R4.1 21.85,44.5 24,46.65 v24,48.8 | v35.1,80.1 40.52,80.1 IC2.24
  Bottom 0.406: v24,48.8 24,52.24 34.85,63.09 34.85,79.85 v35.1,80.1
N$29  (via drill 0.5)
  Top 0.406: v33.2,78.15 33.62,78.58 IC2.25 | R5.1 3.2,45.95 11.25,54 v22.2,54
  Bottom 0.406: v33.2,78.15 33.2,77.25 34.1,76.35 34.1,63.69 24.41,54 v22.2,54
N$30  (via drill 0.5)
  Top 0.406: IC2.1 40.48,71.48 v39.3,70.3 | R9.1 73.09,71.53 71.63,72.99 56.38,72.99 v53.79,70.4
  Bottom 0.406: v53.79,70.4 52.39,69 40,69 39.3,69.7 v39.3,70.3
N$34
  Top 0.406: IC4.5 50.42,44.28 R15.1 50.44,46.39 R14.2
N$35
  Top 0.406: C17.1 R18.1 | R21.2 C17.1 | C17.1 48.45,42.38 IC4.6
N$36  (via drill 0.5)
  Top 0.406: R6.1 62.6,44.2 63.95,45.55 63.95,46.5 v61.9,48.55 | v36.55,77.45 36.88,77.78 IC2.26
  Bottom 0.406: v61.9,48.55 55.3,55.15 55.3,63.05 52.85,65.5 38.1,65.5 36.55,67.05 v36.55,77.45
N$37
  Top 0.406: R53.1 71.72,30.32 R50.2 73.06,21.59 R52.1
  Top 2.54: R52.1 78.71,15.95 Q5.S
N$38
  Top 0.406: 37.79,42.71 IC5.3 | 37.79,42.71 R26.2 | 37.79,42.71 38.07,42.71 R29.2
N$39
  Top 0.406: IC5.2 33.04,41.44 32.2,40.6 32.2,37.06 R33.2
N$40
  Top 0.406: C21.1 38.25,31.39 | IC5.1 34.67,34.97 C21.1 | R27.2 38.41,31.23 C21.1
N$41
  Top 0.406: Q3.G 42.54,15.86 39.25,19.15 37.05,19.15 34.35,21.85 34.35,27.15 34.9,27.7 34.9,29.27 R30.1 35.21,29.59 C21.2 40.8,29.59 R27.1
N$47
  Top 0.406: IC5.5 29.48,45.81 R25.1 29.04,46.24 R24.2
N$48
  Top 0.406: R31.2 C22.1 | C22.1 26.87,42.71 IC5.6 | C22.1 R28.1
N$50
  Top 0.406: 18.77,42.38 IC7.3 | 18.77,42.38 R36.2 | 18.77,42.38 19.12,42.38 R39.2
N$51
  Top 0.406: IC7.2 14.21,41.11 13.4,40.3 13.4,36.92 R43.2
N$52
  Top 0.406: R37.2 C28.1 19.32,31.34 17.5,33.15 17.5,38.39 IC7.1
N$53
  Top 0.406: R37.1 C28.2 19.34,29.47 R40.1 16.2,29.46 16.2,27.6 15.15,26.55 15.15,21.05 16.9,19.3 19.85,19.3 21.29,17.86 Q4.G
N$59
  Top 0.406: IC7.5 10.85,45.82 R35.1 R34.2
N$60
  Top 0.406: C29.1 R38.1 | R41.2 C29.1 | IC7.6 8.42,42.38 C29.1
N$62
  Top 0.406: IC9.3 78.17,42.38 R49.2 R46.2
N$63
  Top 0.406: IC9.2 73.22,41.11 72.5,40.4 72.5,37.3 R53.2
N$64
  Top 0.406: IC9.1 75.2,33.22 C36.1 79.97,30.73 R47.2
N$65
  Top 0.406: R47.1 79.97,29.04 C36.2 77.61,28.97 R50.1 74.75,28.95 74.75,27.2 74.1,26.55 74.1,22.15 76.3,19.95 79.15,19.95 83.79,15.31 Q5.G
N$71
  Top 0.406: IC9.5 70,45.81 R45.1 R44.2
N$72
  Top 0.406: IC9.6 67.55,42.38 C39.1 | R51.2 C39.1 | C39.1 R48.1
N$74  (via drill 0.5)
  Top 0.305: v66.2,65.2 65.59,65.81 IC6.4
  Top 0.406: R16.1 61.49,46.2 v62.3,46.2
  Bottom 0.305: v62.3,46.2 66.2,50.1 v66.2,65.2
N$75  (via drill 0.5)
  Top 0.305: v65.3,63.1 65.3,64.4 64.55,65.16 IC6.5
  Top 0.406: R26.1 39.75,44.75 47.5,52.5 v64.5,52.5
  Bottom 0.305: v64.5,52.5 65.3,53.3 v65.3,63.1
N$76  (via drill 0.5)
  Top 0.305: v64.2,64 63.7,64.5 IC6.6
  Top 0.406: v63.6,55.3 31.3,55.3 26.75,50.75 23.9,50.75 22.4,49.25 22.4,47.2 19.7,44.5 R36.1
  Bottom 0.305: v64.2,64 64.2,55.9 v63.6,55.3
N$77  (via drill 0.5)
  Top 0.305: v72.2,63.6 71.3,64.5 IC6.11
  Top 0.406: R46.1 80.43,46.12 v79.9,46.65
  Bottom 0.406: v72.2,63.6 72.2,54.35 v79.9,46.65
SCK  (via drill 0.5)
  Top 0.305: IC6.14 68.26,66.4 67.2,66.4 66.4,67.2 66.1,67.2 v65.2,68.1
  Top 0.406: IC2.17 46.15,81.05 46.6,81.5 46.6,82.9 45.7,83.8 45.7,86.04 JP1.3
  Bottom 0.305: v65.2,68.1 65.2,68.3 56.9,76.7 56.9,82.21 56.21,82.9 46.6,82.9 45.7,83.8 45.7,86.04 JP1.3
SYNC  (via drill 0.5)
  Top 0.305: IC6.15 67.5,67.1 66.2,68.4 v66.2,69.2 | v58.6,77.1 50,77.1 49.1,76.2 47.67,76.2 IC2.13
  Bottom 0.305: v66.2,69.2 66.2,69.5 v58.6,77.1
VCC  (via drill 0.5, 0.6)
  Top 0.254: L1.2 26.67,62.07 27.1,61.8
  Top 0.406: IC1.2 64.58,81.83 63.4,83 63.4,86.67 R1.1 63.01,87 | IC2.18 45.3,80.02 | IC2.18 45.35,81.95 v45.3,82 | C6.2 51.12,67.08 51,67.2 50.1,67.2 50,67.7 | 45.4,78.5 45.4,78.7 45.4,80.02 IC2.18 | IC7.8 10.85,38.85 10.1,38.1
  Top 0.61: v27.4,37.1 27.4,38.09 IC5.8 | IC4.8 51.05,39.25 v49.4,37.1 | IC9.8 70,38.9 v68.3,37.1 | C4.1 69.33,81.83 IC1.2 | IC8.8 3.77,28.83 v3,29.6 | C32.+ 3.02,29.62 v3,29.6 | C31.2 2.97,29.57 v3,29.6
  Top 0.813: 26.82,61.93 L1.2 26.95,65.52 C1.1 | v49.4,37.1 49.33,37.03 C15.2 | v68.3,37.1 68.28,37.08 C35.2 | C20.2 27.4,37.08 v27.4,37.1 | v46.1,73.5 45.4,74.2 45.4,78.7 | C27.2 15.82,37.03 v15.75,37.1 | v55.51,82 55.51,85.1 57.36,86.95 62.96,86.95 R1.1
  Top 1.016: 26.8,61.5 27.1,61.8 v29.2,61.8
  Top 1.27: v37.2,60.6 36,61.8 v29.2,61.8 | v48.6,60.6 50,62 50,67.7 v50,71.6 | C2.+ 26.95,58.52 L1.2 | v11.1,37.1 10.1,38.1 v2.3,38.1
  Bottom 0.61: v45.3,82 v55.51,82
  Bottom 1.27: v11.1,37.1 v15.75,37.1 v27.4,37.1 v49.4,37.1 v68.3,37.1 | v29.2,61.8 20.8,61.8 11.4,52.4 7.4,52.4 2.3,47.3 v2.3,38.1 2.3,30.3 v3,29.6 | v46.1,73.5 48,71.6 v50,71.6 | v37.2,60.6 v48.6,60.6
VREF  (via drill 0.5)
  Top 0.305: IC6.7 IC6.8 60.33,63.2 C26.1
  Top 0.406: v60.3,69.3 60.2,69.2 58,69.2 56.9,68.1 56.9,65 58.79,63.11 C26.1 | IC2.20 43.75,82.25 v43.5,82.5
  Top 0.61: IC1.6 60.09,83.09 59.3,82.3 59.3,81.4 58.3,80.4 | v55.51,80.4 58.3,80.4 | C5.1 60.07,78.63 58.3,80.4 | C7.2 41.55,82.5 v43.5,82.5
  Bottom 0.406: v60.3,69.3 60.3,70.3 50.2,80.4
  Bottom 0.61: v55.51,80.4 50.2,80.4 44.55,80.4 43.75,81.2 43.75,82.25 v43.5,82.5

### Text on the board
Top: 1.1